# Altium schematic sheet ignition.SchDoc
size A4
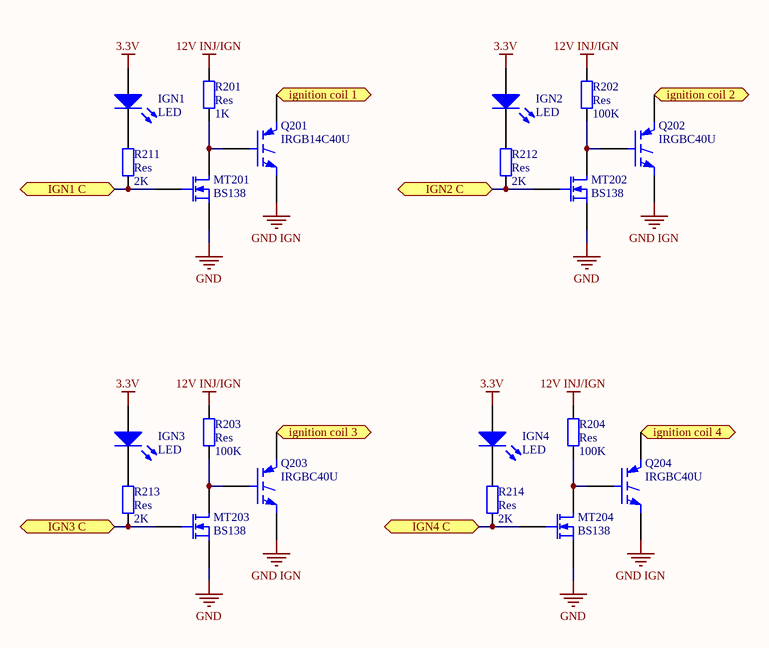
[diagram p0: ignition.SchDoc]

## Parts
IGN1  LED  [LED 3mm]
IGN2  LED  [LED 3mm]
IGN3  LED  [LED 3mm]
IGN4  LED  [LED 3mm]
MT201  BS138  [SOT23]
MT202  BS138  [SOT23]
MT203  BS138  [SOT23]
MT204  BS138  [SOT23]
Q201  IRGB14C40U  [TO-220AB]
Q202  IRGBC40U  [TO-220AB]
Q203  IRGBC40U  [TO-220AB]
Q204  IRGBC40U  [TO-220AB]
R201  Res  value 1K  [1206 footprint]
R202  Res  value 100K  [1206 footprint]
R203  Res  value 100K  [1206 footprint]
R204  Res  value 100K  [1206 footprint]
R211  Res  value 2K  [1206 footprint]
R212  Res  value 2K  [1206 footprint]
R213  Res  value 2K  [1206 footprint]
R214  Res  value 2K  [1206 footprint]

## Ports
IGN1 C (bidir), IGN2 C (bidir), IGN3 C (bidir), IGN4 C (bidir), ignition coil 1 (bidir), ignition coil 2 (bidir), ignition coil 3 (bidir), ignition coil 4 (bidir)

## Nets
3.3V: IGN1.1(A) IGN2.1(A) IGN3.1(A) IGN4.1(A)
12V INJ/IGN: R201.2 R202.2 R203.2 R204.2
GND: MT201.2(S) MT202.2(S) MT203.2(S) MT204.2(S)
GND IGN: Q201.3(E) Q202.3(E) Q203.3(E) Q204.3(E)
IGN1 C: MT201.1(G) R211.1 ; port IGN1 C
IGN2 C: MT202.1(G) R212.1 ; port IGN2 C
IGN3 C: MT203.1(G) R213.1 ; port IGN3 C
IGN4 C: MT204.1(G) R214.1 ; port IGN4 C
ignition coil 1: Q201.2(C) ; port ignition coil 1
ignition coil 2: Q202.2(C) ; port ignition coil 2
ignition coil 3: Q203.2(C) ; port ignition coil 3
ignition coil 4: Q204.2(C) ; port ignition coil 4
NetIGN1_2: IGN1.2(K) R211.2
NetIGN2_2: IGN2.2(K) R212.2
NetIGN3_2: IGN3.2(K) R213.2
NetIGN4_2: IGN4.2(K) R214.2
NetMT201_3: MT201.3(D) Q201.1(G) R201.1
NetMT202_3: MT202.3(D) Q202.1(G) R202.1
NetMT203_3: MT203.3(D) Q203.1(G) R203.1
NetMT204_3: MT204.3(D) Q204.1(G) R204.1

## Library data of the parts
Q201-Q204 = IRGBC40U: Insulated Gate Bipolar Transistor; Note: Pin 2 (collector) is electrically connected to the TAB; Published: 8-Jun-2000; LatestRevisionDate: 17-Sep-2003; LatestRevisionNote: SIM Port Mapping Fixed.; DatasheetVersion: PD-9.683A; PackageVersion: Feb-1997; PackageReference: TO-220AB; Publisher: Altium Limited; PackageDescription: TO, Thru-Hole, Vertical, Heatsink Mounted; 3 In-Line Leads; Pitch 2.54 mm; ComponentLink1Description: Manufacturer Link; ComponentLink1URL: http://www.irf.com/